# EAGLE design ModuloAutomacao (EAGLE 8.7.0)
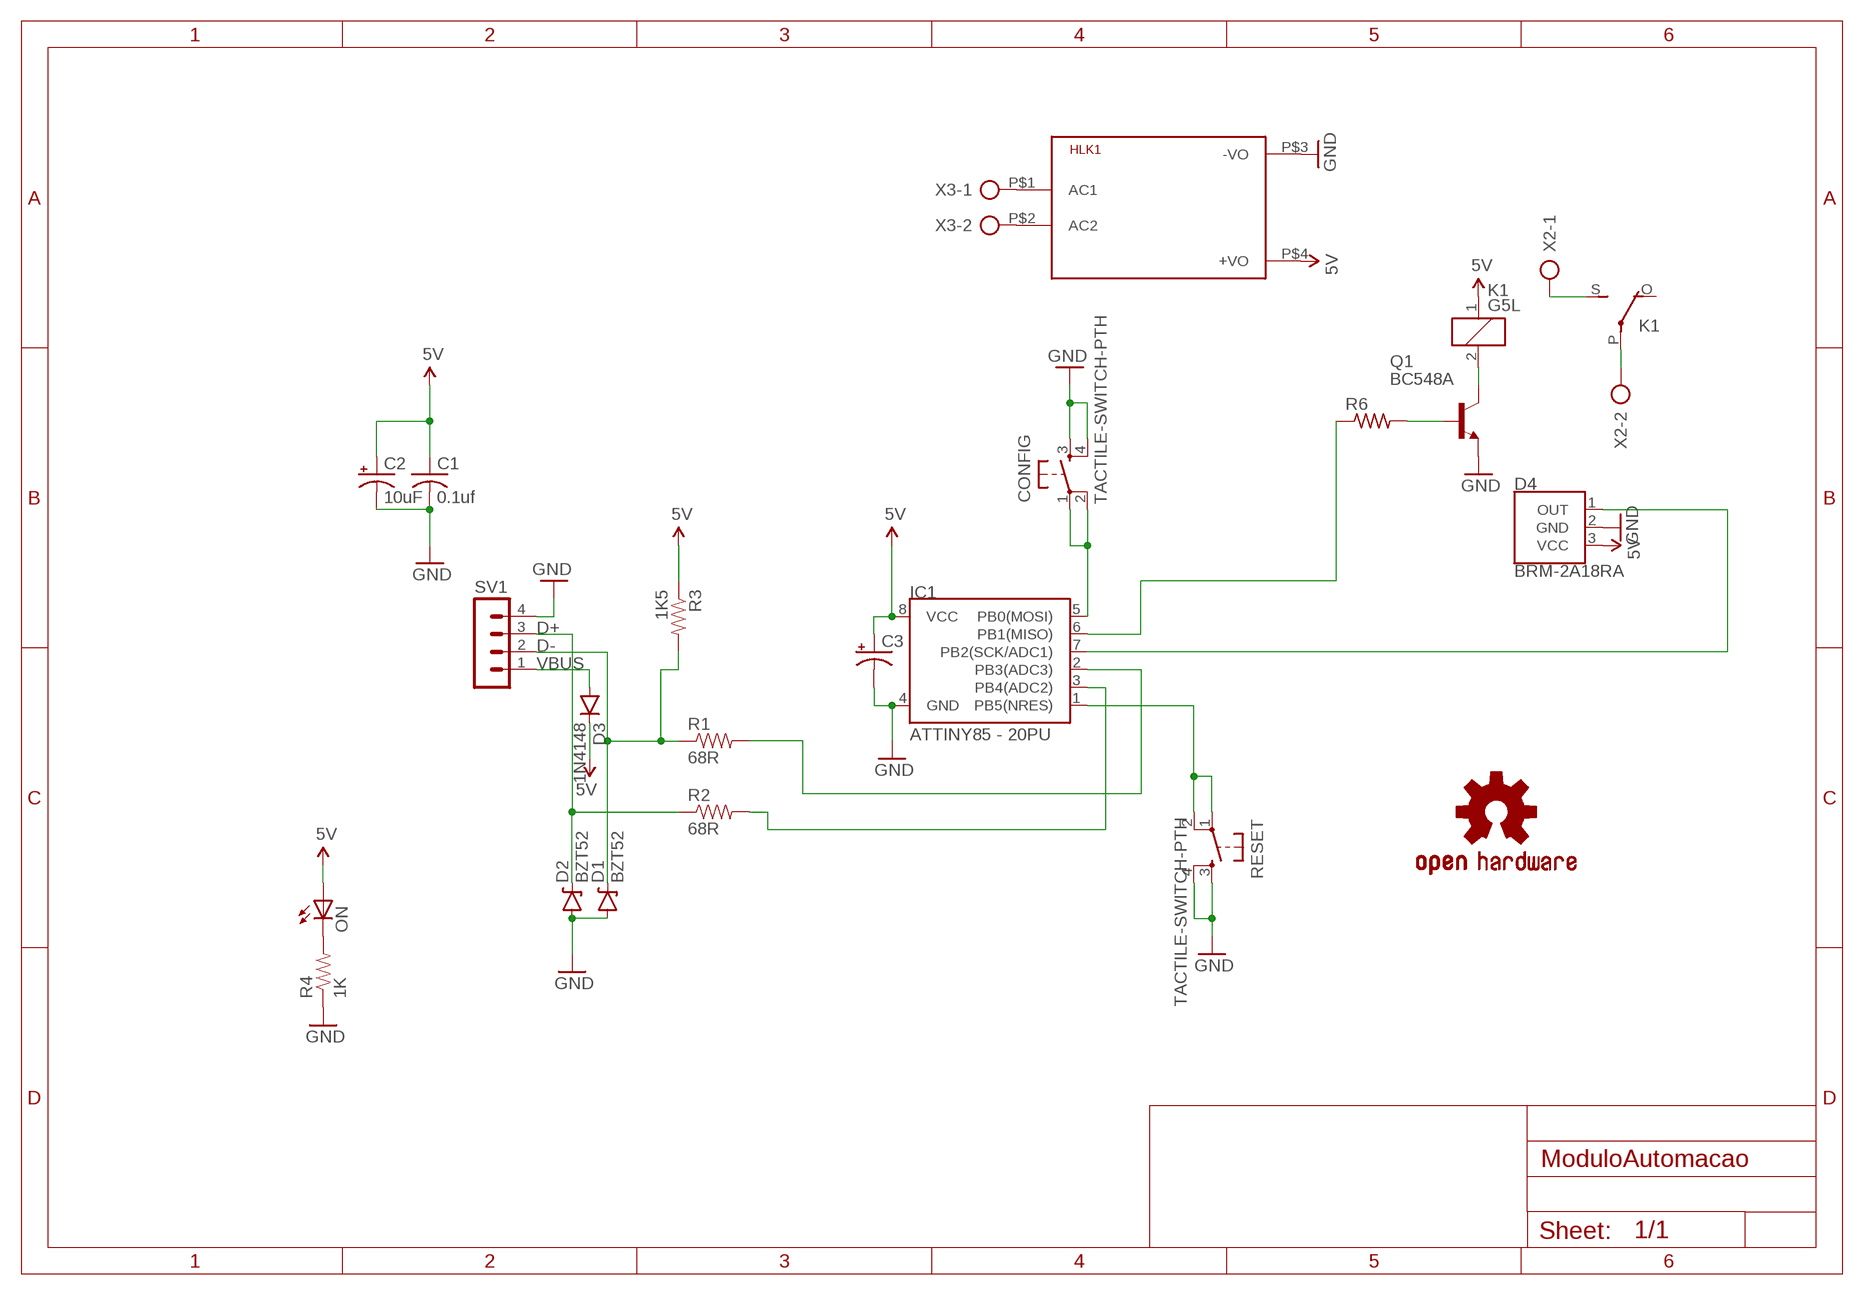
[diagram p0: schematic, sheet 1]

## Parts
C1  0.1uf  C-US025-025X050  [C025-025X050]
C2  10uF  CPOL-USE2,5-6E  [E2,5-6E]
C3  CPOL-USE1.8-4  [E1,8-4]
CONFIG  TACTILE-SWITCH-PTH  [TAC-SWITCH-PTH]
D1  BZT52  DIODE-ZENER  [DIODE-BZT52]
D2  BZT52  DIODE-ZENER  [DIODE-BZT52]
D3  1N4148  DIODE1N4148  [DIODE-1N4148]
D4  BRM-2A18RA  [BRM-2508]
HLK1  HLK-PM013W  [HLK-PM01]
IC1  ATTINY85 - 20PU  ATTINY45TINY45-20-DIP  [DIP08]
K1  G5L  [G5LE]
LOGO1  OSHW-LOGOM  [OSHW-LOGO-M]
ON  LED3MM  [LED3MM]
Q1  BC548A  [TO92-EBC]
R1  68R  RESISTORPTH-1/4W  [AXIAL-0.4]
R2  68R  RESISTORPTH-1/4W  [AXIAL-0.4]
R3  1K5  RESISTORPTH-1/4W  [AXIAL-0.4]
R4  1K  RESISTORPTH-1/4W  [AXIAL-0.4]
R6  R-US_0204/7  [0204/7]
RESET  TACTILE-SWITCH-PTH  [TAC-SWITCH-PTH]
SV1  MA04-1  [MA04-1]
X2  AK300/2  [AK300/2]
X3  AK300/2  [AK300/2]

## Nets
5V: C1.1 C2.+ C3.+ D3.C D4.3(VCC) HLK1.P$4(+VO) IC1.8(VCC) K1.1 ON.A R3.P$1
D+: D2.C R2.P$1 SV1.3
D-: D1.C R1.P$1 R3.P$2 SV1.2
GND: C1.2 C2.- C3.- CONFIG.3 CONFIG.4 D1.A D2.A D4.2(GND) HLK1.P$3(-VO) IC1.4(GND) Q1.E R4.P$1 RESET.3 RESET.4 SV1.4
N$1: IC1.2(PB3(ADC3)) R1.P$2
N$2: IC1.6(PB1(MISO)) R6.1
N$3: CONFIG.1 CONFIG.2 IC1.5(PB0(MOSI))
N$5: D4.1(OUT) IC1.7(PB2(SCK/ADC1))
N$6: IC1.3(PB4(ADC2)) R2.P$2
N$8: IC1.1(PB5(NRES)) RESET.1 RESET.2
N$9: K1.2 Q1.C
N$13: Q1.B R6.2
N$14: HLK1.P$1(AC1) X3.1
N$15: HLK1.P$2(AC2) X3.2
N$16: K1.P(2:P) X2.2
N$17: ON.K(C) R4.P$2
N$18: K1.S(2:S) X2.1
VBUS: D3.A SV1.1
Unconnected: K1.O(2:O)

## Library data of the parts
C1 = adafruit:C-US: CAPACITOR, American symbol
C2 = adafruit:CPOL-US: POLARIZED CAPACITOR, American symbol
C3 = rcl:CPOL-US: POLARIZED CAPACITOR, American symbol; SPICEPREFIX: C
CONFIG RESET = GeekAmmo:TACTILE-SWITCH: Tactile Switch 4 Pins, SPST NO
D1 D2 = SparkFun-DiscreteSemi:DIODE-ZENER: Zener Diode Production Part - 8199 3.4V Zener Voltage; PROD-ID: DIO-08199
D3 = SparkFun-DiscreteSemi:DIODE: Diode These are standard reverse protection diodes and small signal diodes. SMA package can handle up to about 1A. SOD-323 can handle about 200mA. What the SOD-323 package when ordering, there are some mfgs out there that are 5-pin packages.; PROD_ID: DIO-08378
D4 = SparkFun-Sensors:BRM-2A18: BRM-2A18 IR Receiver The BRM-2A18 is miniaturized infrared receiver for remote control and other applications requiring improved ambient light rejection. Vertical package is a primary component on the ZX Distance and Gesture Sensor. RA package is not currently in-use. Example Datasheet <http://www.sinoskysun.com/upload/20110512/201105120447164615.PDF> SparkFun Products ZX Distance and Gesture Sensor <https://www.sparkfun.com/products/12780> (COM-12780)
HLK1 = HLK-PM01:HLK-PM01: Hi-Link Power Supply HLK-PM01 3W Author: Ahmed Said <https://github.com/AhmedSaid/EAGLELibraries>
IC1 = SparkFun-DigitalIC:ATTINY45: Atmel 8-pin 2/4/8kB flash uC; PROD_ID: IC-09439; VALUE: TINY45-20-DIP
K1 = relay:G5L: RELAY 1 x switch, 10 A/120 V AC, 8 A/30 V ADC, Omron; OC_FARNELL: unknown; OC_NEWARK: unknown
LOGO1 = SparkFun-Aesthetics:OSHW-LOGO: Open Source Hardware Logo This logo indicates the piece of hardware it is found on incorporates a OSHW license and/or adheres to the definition of open source hardware found here: http://freedomdefined.org/OSHW
ON = adafruit:LED: LED OSRAM: - CHIPLED LG R971, LG N971, LY N971, LG Q971, LY Q971, LO R971, LY R971 LH N974, LH R974 LS Q976, LO Q976, LY Q976 LO Q996 - Hyper CHIPLED LW Q18S LB Q993, LB Q99A, LB R99A - SideLED LS A670, LO A670, LY A670, LG A670, LP A670 LB A673, LV A673, LT A673, LW A673 LH A674 LY A675 LS A676, LA A676, LO A676, LY A676, LW A676 LS A679, LY A679, LG A679 - Hyper Micro SIDELED® LS Y876, LA Y876, LO Y876, LY Y876 LT Y87S - SmartLED LW L88C, LW L88S LB L89C, LB L89S, LG L890 LS L89K, LO L89K, LY L89K LS L896, LA L896, LO L896, LY L896 - TOPLED LS T670, LO T670, LY T670, LG T670, LP T670 LSG T670, LSP T670, LSY T670, LOP T670, LYG T670 LG T671, LOG T671, LSG T671 LB T673, LV T673, LT T673, LW T673 LH T674 LS T676, LA T676, LO T676, LY T676, LB T676, LH T676, LSB T676, LW T676 LB T67C, LV T67C, LT T67C, LS T67K, LO T67K, LY T67K, LW E67C LS E67B, LA E67B, LO E67B, LY E67B, LB E67C, LV E67C, LT E67C LW T67C LS T679, LY T679, LG T679 LS T770, LO T770, LY T770, LG T770, LP T770 LB T773, LV T773, LT T773, LW T773 LH T774 LS E675, LA E675, LY E675, LS T675 LS T776, LA T776, LO T776, LY T776, LB T776 LHGB T686 LT T68C, LB T68C - Hyper Mini TOPLED® LB M676 - Mini TOPLED Santana® LG M470 LS M47K, LO M47K, LY M47K Source: http://www.osram.convergy.de/
Q1 = transistor-npn:BC548*: NPN Transistor
R1-R4 = SparkFun-Passives:RESISTOR: Resistor Basic schematic elements and footprints for 0603, 1206, and PTH resistors.
R6 = resistor:R-US_: RESISTOR, American symbol
SV1 = con-lstb:MA04-1: PIN HEADER; OC_FARNELL: unknown; OC_NEWARK: unknown
X2 X3 = con-ptr500:AK300/2: CONNECTOR; OC_FARNELL: unknown; OC_NEWARK: unknown

## Net classes
0 default: width 0.8 mm, drill 0.8 mm, clearance 0.5 mm

## Board
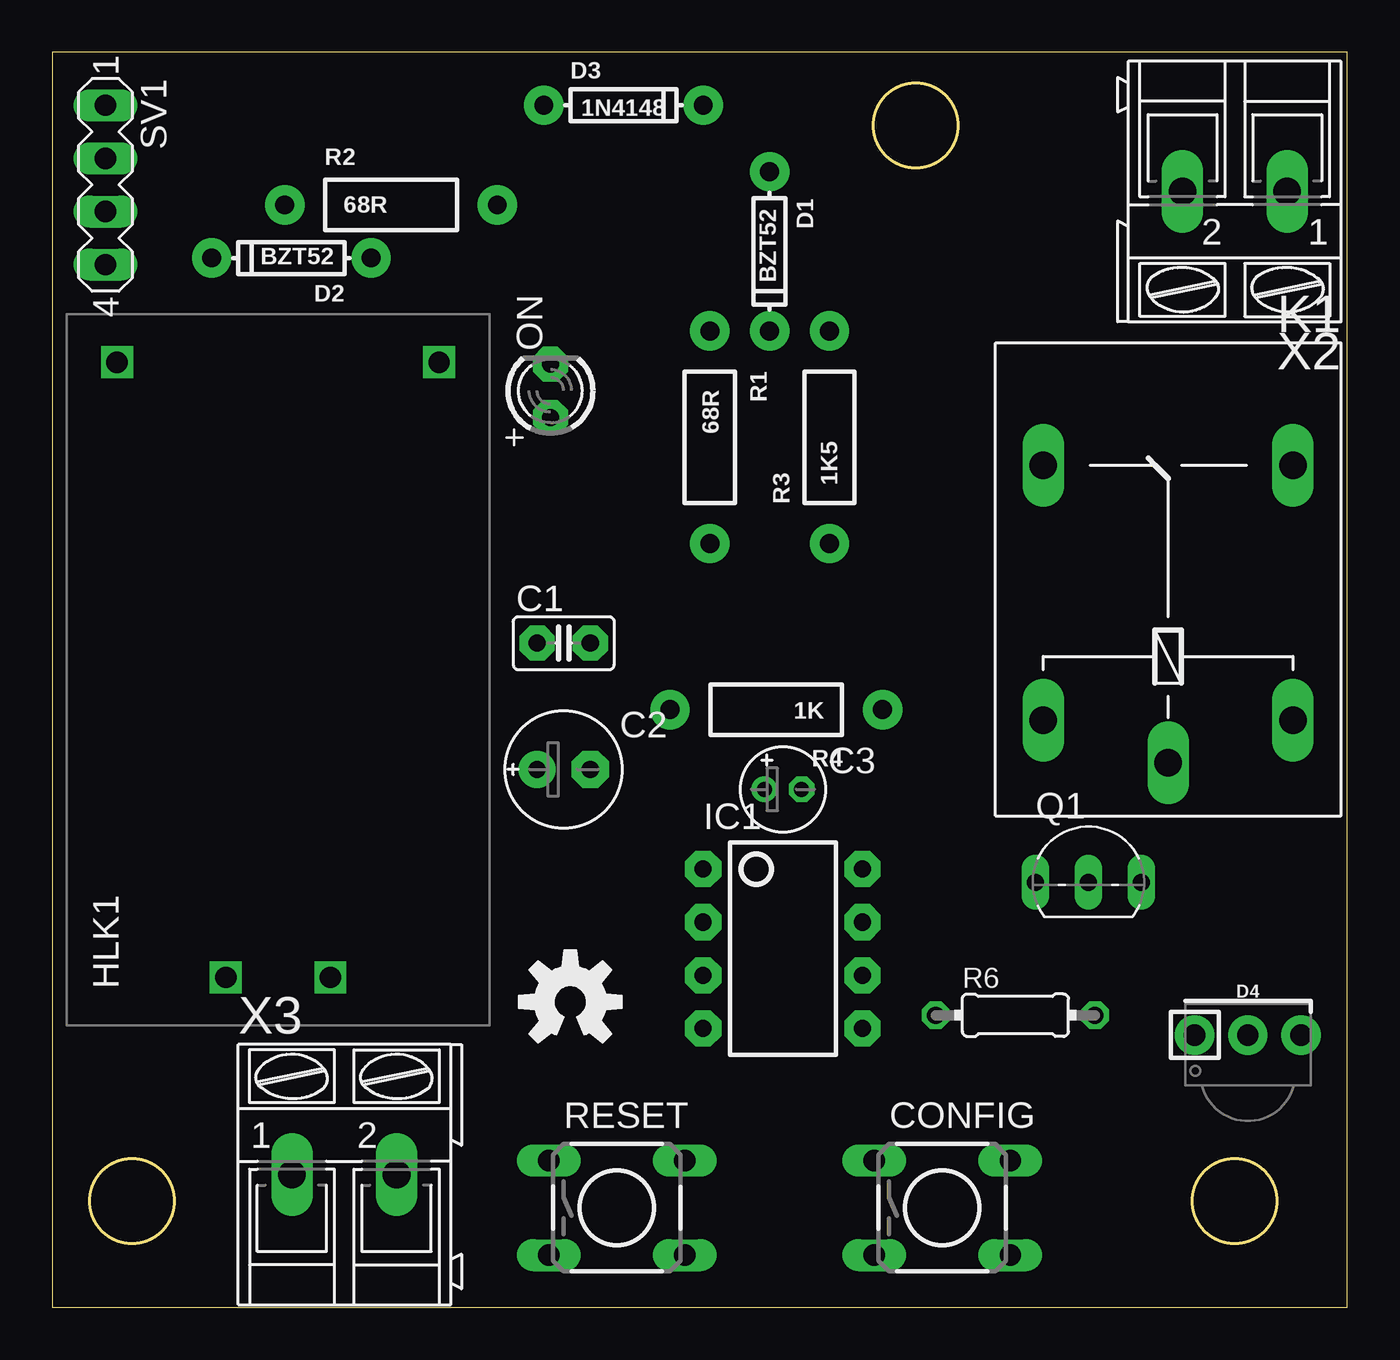
[diagram p1: board, top side]
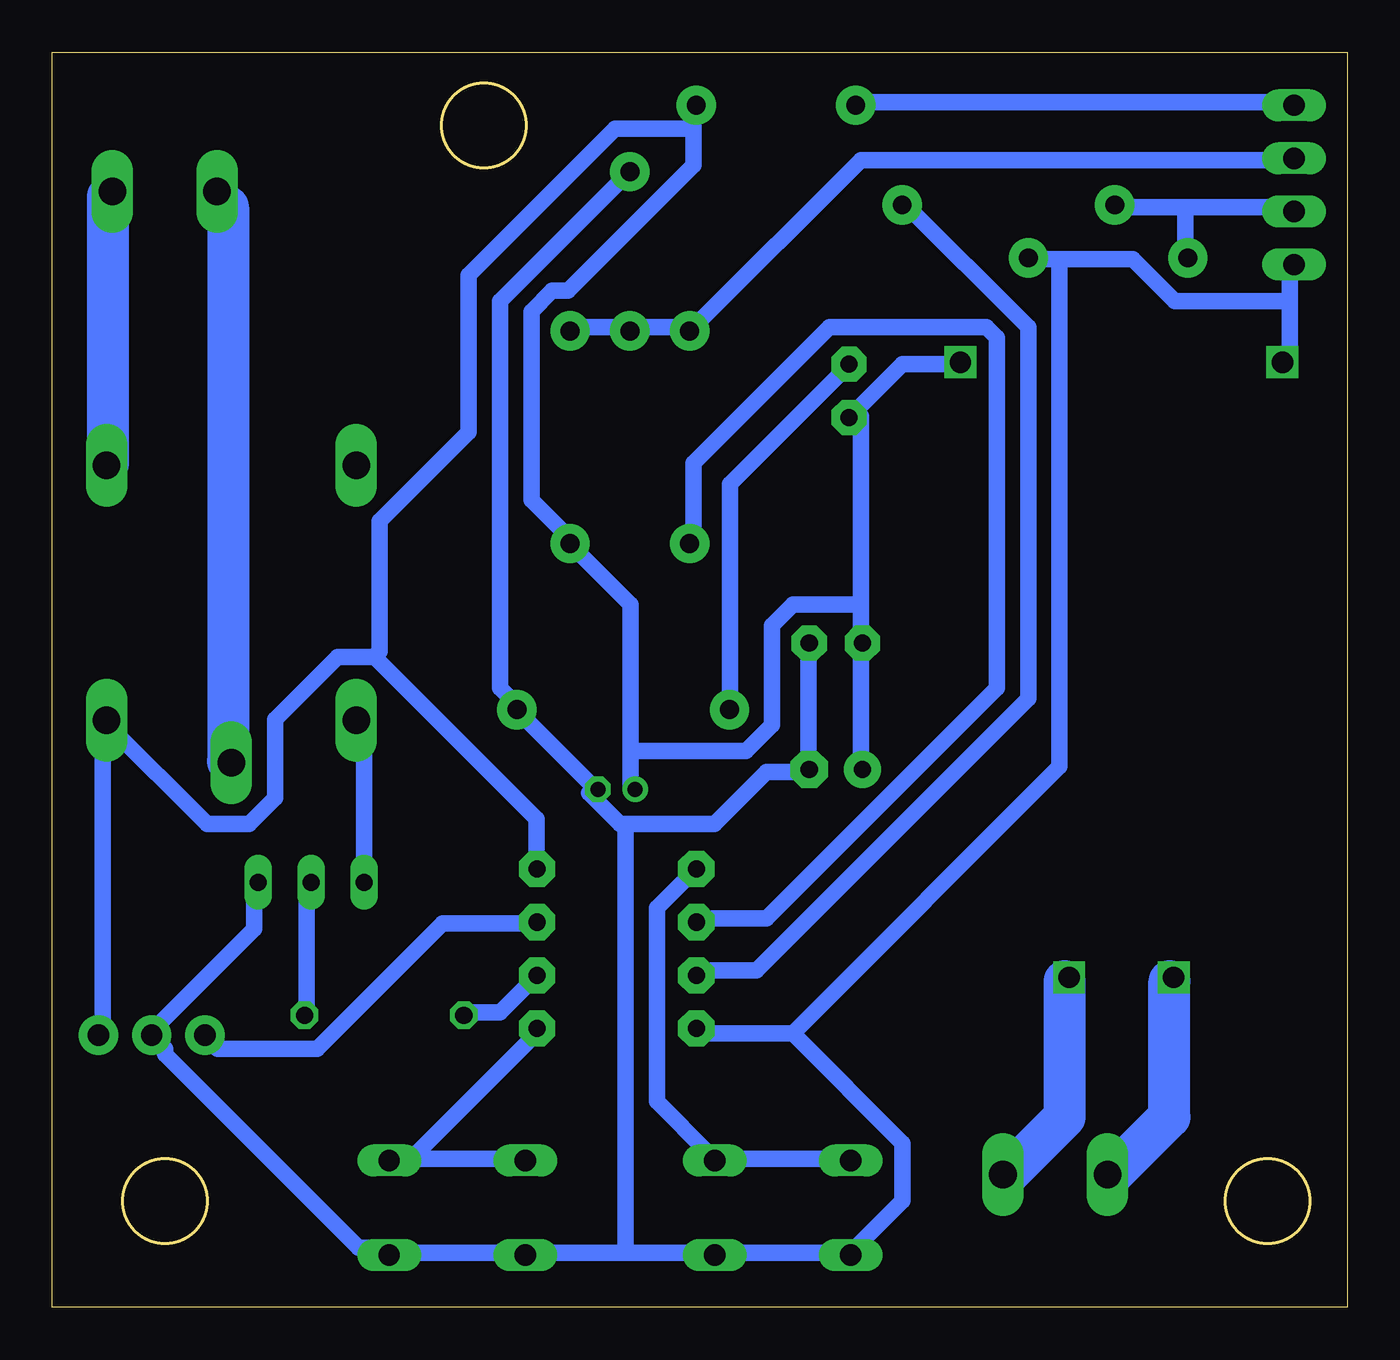
[diagram p2: board, bottom side, seen from below]

Size 61.9 x 60 mm. Coordinates in mm from the lower left corner, seen from the top.
Outline: 0,0 61.9,0 61.9,60 0,60 0,0
Outline: circle at 56.52,5.08 radius 2.01
Outline: circle at 3.81,5.08 radius 2.01
Outline: circle at 41.27,56.5 radius 2.01
Copper layers (1*16): Top 0.035mm / dielectric 1.5mm / Bottom 0.035mm
Design rules "default": minimum track width 6mil, minimum drill 0.35mm, track to track 6mil, track to pad 6mil, pad to pad 6mil, via to via 6mil, smd to smd 6mil, copper to edge 40mil, drill to drill 6mil, minimum pad ring 10mil, minimum via ring 8mil, stop-mask expansion 4mil, vias tented up to drill 0mil, thermal gap 10mil

### Footprints (pad centres in the part's own frame; a part is rotated, then mirrored left to right if it is on the bottom)
C025-025X050 = drill 0.813 pad 1.676 octagon: 1 -1.27,0; 2 1.27,0
E2,5-6E = drill 0.813 pad 1.778: + -1.27,0 | drill 0.813 pad 1.778 octagon: - 1.27,0
E1,8-4 = drill 0.711 pad 1.168: + -0.889,0 | drill 0.711 pad 1.168 octagon: - 0.889,0
TAC-SWITCH-PTH = drill 1.016 pad 1.524 long: 1 -3.251,2.261; 2 3.251,2.261; 3 -3.251,-2.261; 4 3.251,-2.261
DIODE-BZT52 = drill 0.9 pad 1.88: A -3.81,0; C 3.81,0
DIODE-1N4148 = drill 0.9 pad 1.88: A -3.81,0; C 3.81,0
BRM-2508 = drill 1.016 pad 1.88: 1 -2.54,0; 2 0,0; 3 2.54,0
HLK-PM01 = drill 1.016 square: P$1 -14.7,2.5; P$2 -14.7,-2.5; P$3 14.7,7.7; P$4 14.7,-7.7
DIP08 = drill 0.813 pad 1.727 octagon: 1 -3.81,-3.81; 2 -1.27,-3.81; 3 1.27,-3.81; 4 3.81,-3.81; 5 3.81,3.81; 6 1.27,3.81; 7 -1.27,3.81; 8 -3.81,3.81
G5LE = drill 1.321 long: 1 -7.493,-5.969; 2 -7.493,5.969; O 4.699,5.969; P -9.525,0; S 4.699,-5.969
LED3MM = drill 0.813 pad 1.676 octagon: A -1.27,0; K 1.27,0
TO92-EBC = drill 0.813 long: B 0,-1.27; C -2.54,-1.27; E 2.54,-1.27
AXIAL-0.4 = drill 0.9 pad 1.88: P$1 -5.08,0; P$2 5.08,0
0204/7 = drill 0.813 octagon: 1 -3.81,0; 2 3.81,0
MA04-1 = drill 1.016 long: 1 -3.81,0; 2 -1.27,0; 3 1.27,0; 4 3.81,0
AK300/2 = drill 1.321 long: 1 -2.515,0; 2 2.489,0

### Placement (x,y rotation side)
C1  24.45,31.75 0 top
C2  24.45,25.72 0 top
C3  34.92,24.77 0 top
CONFIG  42.55,4.76 0 top
D1  34.29,50.48 270 top
D2  11.43,50.16 180 top
D3  27.3,57.47 0 top
D4  57.15,13.02 0 top
HLK1  10.79,30.48 90 top
IC1  34.92,17.14 270 top
K1  53.34,35.56 90 top
LOGO1  24.77,14.61 0 top
ON  23.81,43.82 90 top
Q1  49.53,21.59 0 top
R1  31.43,41.59 270 top
R2  16.19,52.7 0 top
R3  37.15,41.59 90 top
R4  34.61,28.58 180 top
R6  46.04,13.97 0 top
RESET  26.99,4.76 0 top
SV1  2.54,53.66 270 top
X2  56.52,53.34 180 top
X3  13.97,6.35 0 top

### Tracks (layer width: path | path; a pad name or v marks a point on that pad's centre or on a via)
5V
  Bottom 0.8: 46.5,31.1 38.75,23.35 38.75,21.1 IC1.8 | 46.5,31.1 48.25,31.1 51.25,28.1 51.25,24.35 52.5,23.1 54.5,23.1 59.25,27.85 K1.1 59.5,27.6 59.5,13.1 D4.3 | C2.+ 23.25,25.85 23.25,31.6 C1.1 23.25,32.1 23.25,33.6 | HLK1.P$4 18.5,45.1 21.25,45.1 23.75,42.6 ON.A 23.25,42.6 23.25,33.6 | 34.25,26.6 34.25,33.6 37,36.35 R3.P$1 37.25,36.85 39,38.6 39,47.6 38,48.6 37.25,48.6 31.25,54.6 31.25,56.35 | 34.25,26.6 34.25,24.85 C3.+ | 31.25,56.35 31.25,57.35 D3.C | 23.25,33.6 26.5,33.6 27.5,32.6 27.5,27.85 28.75,26.6 34.25,26.6 | 31.25,56.35 35,56.35 42,49.35 42,41.85 46.25,37.6 46.25,31.35 46.5,31.1
D+
  Bottom 0.8: 7.75,52.6 11,52.6 R2.P$1 | 7.75,52.6 2.75,52.6 SV1.3 | 7.75,52.6 7.75,50.35 D2.C
D-
  Bottom 0.8: SV1.2 2.75,54.85 23.25,54.85 31.25,46.85 R1.P$1 31.75,46.85 34.25,46.85 D1.C 34.5,46.85 37,46.85 R3.P$2
GND
  Bottom 0.8: C1.2 25.75,31.6 25.75,25.85 C2.- 26,25.6 27.75,25.6 30.25,23.1 34.5,23.1 | D1.A 34.5,54.1 40.5,48.1 40.5,29.6 39.75,28.85 R4.P$1 39.5,28.35 36,24.85 C3.- 36.25,24.6 34.75,23.1 34.5,23.1 | 2.75,48.1 2.75,45.6 3,45.35 HLK1.P$3 | 2.75,48.1 2.75,49.6 SV1.4 | 13.75,50.1 10.25,50.1 8.25,48.1 2.75,48.1 | 13.75,50.1 15,50.1 D2.A | Q1.E 52.25,20.1 52.25,18.1 57.25,13.1 D4.2 57,12.85 56.5,12.35 56.5,12.1 47.25,2.85 46,2.85 CONFIG.4 45.75,2.6 39.5,2.6 CONFIG.3 39,2.6 34.5,2.6 | 26.5,13.1 31,13.1 IC1.4 | 26.5,13.1 21.25,7.85 21.25,5.1 23.5,2.85 RESET.3 23.75,2.6 30,2.6 RESET.4 30.5,2.6 34.5,2.6 | 13.75,50.1 13.75,25.85 26.5,13.1 | 34.5,2.6 34.5,23.1
N$1
  Bottom 0.8: IC1.2 31,18.6 27.75,18.6 16.75,29.6 16.75,46.35 17.25,46.85 24.75,46.85 31.25,40.35 31.25,36.6 R1.P$2
N$2
  Bottom 0.8: R6.1 42,14.1 40.5,14.1 38.75,15.85 IC1.6
N$3
  Bottom 0.8: CONFIG.1 39.5,7.1 45.75,7.1 CONFIG.2 44.5,7.35 38.75,13.1 IC1.5
N$5
  Bottom 0.8: IC1.7 38.75,18.35 43.25,18.35 49.25,12.35 54,12.35 54.5,12.85 D4.1
N$6
  Bottom 0.8: IC1.3 31,16.1 28.25,16.1 15.25,29.1 15.25,46.85 21.25,52.85 R2.P$2
N$8
  Bottom 0.8: RESET.1 23.75,7.1 30,7.1 RESET.2 30.5,7.35 33,9.85 33,19.1 31.25,20.85 IC1.1
N$9
  Bottom 0.8: Q1.C 47,20.35 47,27.6 47.25,27.85 K1.2
N$13
  Bottom 0.8: R6.2 49.75,14.1 49.75,20.1 Q1.B
N$14
  Bottom 0.8: 8.5,15.6 HLK1.P$1 | 11.25,6.35 X3.1
  Bottom 2: 8.5,15.6 8.5,9.1 11.25,6.35
N$15
  Bottom 0.8: 13.5,15.6 HLK1.P$2 | 16.25,6.35 X3.2
  Bottom 2: 13.5,15.6 13.5,9.1 16.25,6.35
N$16
  Bottom 0.8: 53.5,52.6 54,53.1 X2.2 | 53.5,26.1 K1.P
  Bottom 2: 53.5,52.6 53.5,26.1
N$17
  Bottom 0.8: ON.K 24,44.85 29.5,39.35 29.5,28.6 R4.P$2
N$18
  Bottom 0.8: 59.25,40.35 K1.S | 59.25,53.1 X2.1
  Bottom 2: 59.25,53.1 59.25,40.35
VBUS
  Bottom 0.8: SV1.1 2.75,57.6 23.25,57.6 D3.A